# Altium schematic sheet etna-sch-driver.SchDoc
size A4; SheetNumber: 4; SheetTotal: 6; PageSetup: Record=PageOptions|CenterHorizontal=True|CenterVertical=True|PrintScale=0.73|XCorrection=1.00|YCorrection=1.00|PrintKind=1|BorderSize=5000000|LeftOffset=0|BottomOffset=0|Orientation=2|PaperLength=1000|PaperWidth=1000|Scale=100|PaperSource=15|PrintQuality=1200|MediaType=1|DitherType=10|PaperKind=A4|PrintScaleMode=1
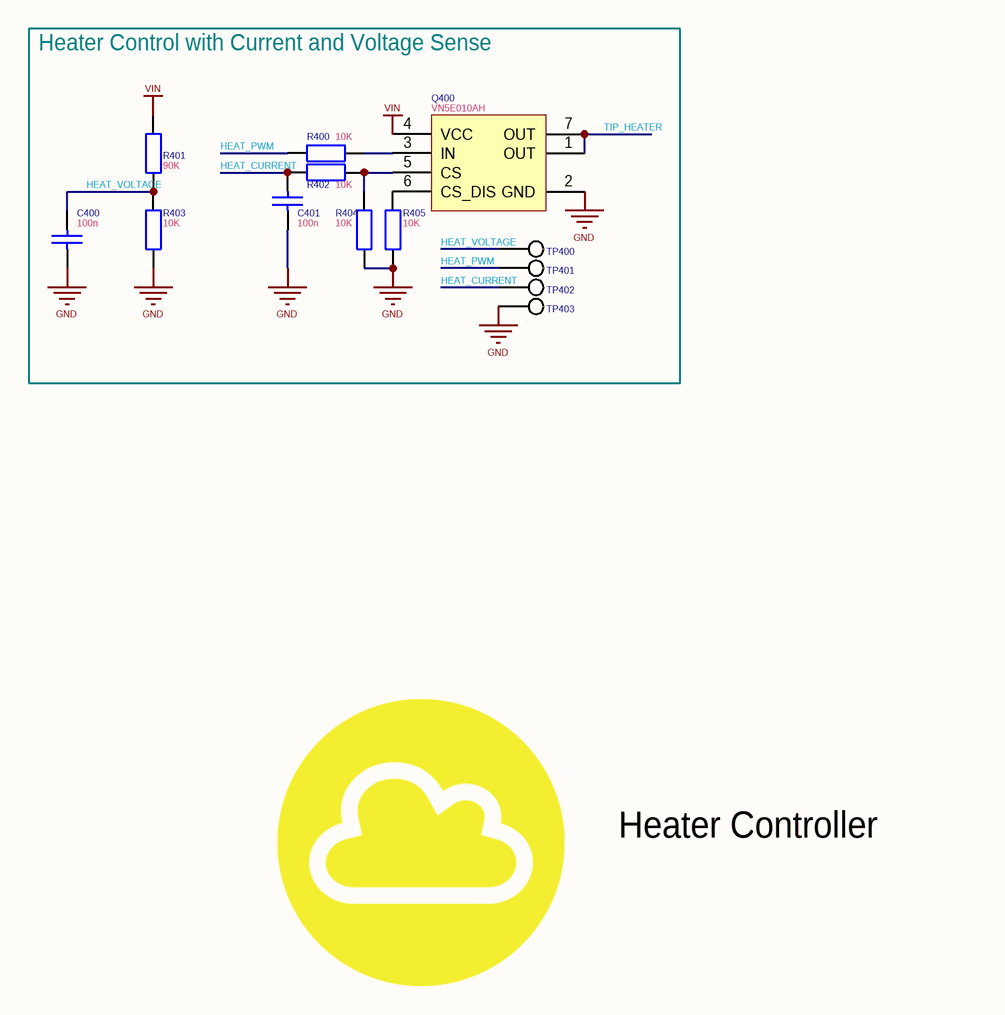
[diagram p0: etna-sch-driver.SchDoc]

## Parts
C400  100n  [0402-capacitor]
C401  100n  [0402-capacitor]
Q400  VN5E010AH  [HPAK6]
R400  10K  [0402-resistor]
R401  90K  [0402-resistor]
R402  10K  [0402-resistor]
R403  10K  [0402-resistor]
R404  10K  [0402-resistor]
R405  10K  [0402-resistor]
TP400  TP  [TESTPOINT]  (value not drawn)
TP401  TP  [TESTPOINT]  (value not drawn)
TP402  TP  [TESTPOINT]  (value not drawn)
TP403  TP  [TESTPOINT]  (value not drawn)

## Blocks framed on the sheet
Heater Control with Current and Voltage Sense: C400 C401 Q400 R400-R405 TP400-TP403

## Nets
GND: C400.1 C401.1 Q400.2(GND) R403.2 R404.2 R405.2 TP403.1(GND)
VIN: Q400.4(VCC) R401.1
HEAT_CURRENT: C401.2 R402.2 TP402.1(GND)
HEAT_PWM: R400.2 TP401.1(GND)
HEAT_VOLTAGE: C400.2 R401.2 R403.1 TP400.1(GND)
TIP_HEATER: Q400.1(OUT) Q400.7(OUT)
NetQ400_3: Q400.3(IN) R400.1
NetQ400_5: Q400.5(CS) R402.1 R404.1
NetQ400_6: Q400.6(CS_DIS) R405.1

## Notes on the sheet
- Heater Controller

## Library data of the parts
C400 C401 = CAP: Capacitor
Q400 = VN5E010AH: 10 m high-side driver with analog current sense  for automotive applications
R400-R405 = RES: Resistor
TP400-TP403 = TEST_POINT